# EAGLE design ARE_adaptadora_dsPIC-PIC32_44pin (EAGLE 6.5.0)
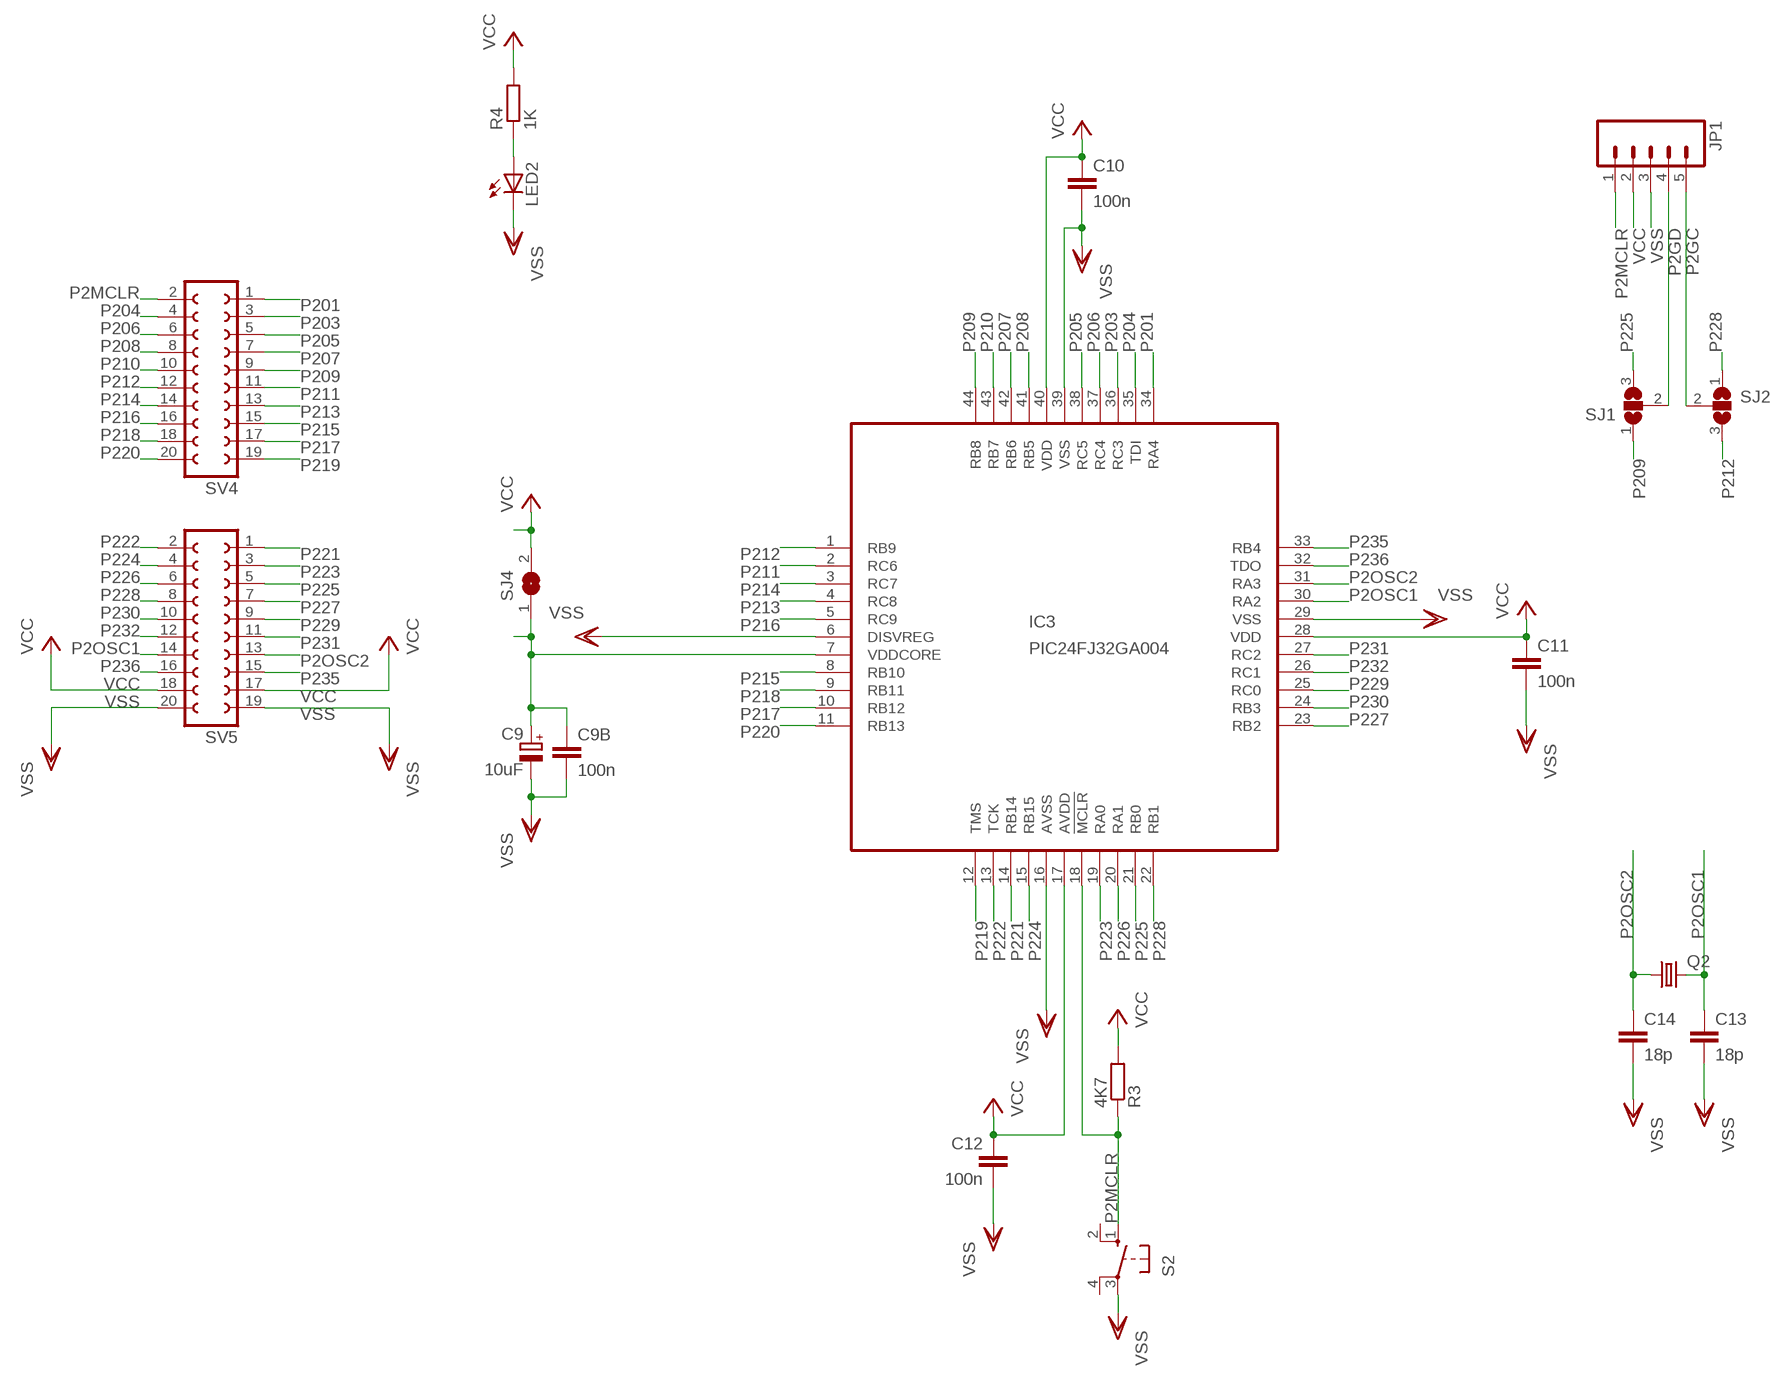
[diagram p0: schematic, sheet 1]

## Parts
C9  10uF  CPOL-EUSMCC  [SMC_C]
C9B  100n  C-EUC0805  [C0805]
C10  100n  C-EUC0805  [C0805]
C11  100n  C-EUC0805  [C0805]
C12  100n  C-EUC0805  [C0805]
C13  18p  C-EUC0805  [C0805]
C14  18p  C-EUC0805  [C0805]
IC3  PIC24FJ32GA004  [TQFP44]
JP1  M05PTH  [1X05]
LED2  LEDCHIPLED_0805  [CHIPLED_0805]
Q2  CRYSTALHC18U-V  [HC18U-V]
R3  4K7  R-EU_R0805  [R0805]
R4  1K  R-EU_R0805  [R0805]
S2  10-XX  [B3F-10XX]
SJ1  SJ2W  [SJ_2]
SJ2  SJ2W  [SJ_2]
SJ4  SJ  [SJ]
SV4  FE10-2W  [FE10-2W]
SV5  FE10-2W  [FE10-2W]

## Nets
N$2: LED2.A R4.1
N$11: C9.+ C9B.1 IC3.7(VDDCORE) SJ4.1
P2GC: JP1.5 SJ2.2
P2GD: JP1.4 SJ1.2
P2MCLR: IC3.18(!MCLR) JP1.1 R3.1 S2.1(S) SV4.2
P2OSC1: C13.1 IC3.30(RA2) Q2.2 SV5.14
P2OSC2: C14.1 IC3.31(RA3) Q2.1 SV5.13
P201: IC3.34(RA4) SV4.1
P203: IC3.36(RC3) SV4.3
P204: IC3.35(TDI) SV4.4
P205: IC3.38(RC5) SV4.5
P206: IC3.37(RC4) SV4.6
P207: IC3.42(RB6) SV4.7
P208: IC3.41(RB5) SV4.8
P209: IC3.44(RB8) SJ1.1 SV4.9
P210: IC3.43(RB7) SV4.10
P211: IC3.2(RC6) SV4.11
P212: IC3.1(RB9) SJ2.3 SV4.12
P213: IC3.4(RC8) SV4.13
P214: IC3.3(RC7) SV4.14
P215: IC3.8(RB10) SV4.15
P216: IC3.5(RC9) SV4.16
P217: IC3.10(RB12) SV4.17
P218: IC3.9(RB11) SV4.18
P219: IC3.12(TMS) SV4.19
P220: IC3.11(RB13) SV4.20
P221: IC3.14(RB14) SV5.1
P222: IC3.13(TCK) SV5.2
P223: IC3.19(RA0) SV5.3
P224: IC3.15(RB15) SV5.4
P225: IC3.21(RB0) SJ1.3 SV5.5
P226: IC3.20(RA1) SV5.6
P227: IC3.23(RB2) SV5.7
P228: IC3.22(RB1) SJ2.1 SV5.8
P229: IC3.25(RC0) SV5.9
P230: IC3.24(RB3) SV5.10
P231: IC3.27(RC2) SV5.11
P232: IC3.26(RC1) SV5.12
P235: IC3.33(RB4) SV5.15
P236: IC3.32(TDO) SV5.16
VCC: C10.1 C11.1 C12.1 IC3.17(AVDD) IC3.28(VDD) IC3.40(VDD) JP1.2 R3.2 R4.2 SJ4.2 SV5.17 SV5.18
VSS: C9.- C9B.2 C10.2 C11.2 C12.2 C13.2 C14.2 IC3.6(DISVREG) IC3.16(AVSS) IC3.29(VSS) IC3.39(VSS) JP1.3 LED2.C S2.3(P) SV5.19 SV5.20
Unconnected: S2.2(S1) S2.4(P1)

## Library data of the parts
C9 = rcl:CPOL-EU: POLARIZED CAPACITOR, European symbol
C9B C10-C14 = rcl:C-EU: CAPACITOR, European symbol
IC3 = microchip:PIC24FJ32GA004: PIC24FJ32GA004 edit this description Auto generated by make-symbol-device-package-bsdl.ulp Rev. 25 Source: PIC24FJ32GA004.bsd; MPN: PIC24FJ32GA004-E/PT; OC_FARNELL: 1332295; OC_NEWARK: 98M1915
JP1 = SparkFun:M05: Header 5 Standard 5-pin 0.1" header. Use with straight break away headers (SKU : PRT-00116), right angle break away headers (PRT-00553), swiss pins (PRT-00743), machine pins (PRT-00117), and female headers (PRT-00115). Molex polarized connector foot print use with SKU : PRT-08230 with associated crimp pins and housings.
LED2 = led:LED: LED OSRAM: - CHIPLED LG R971, LG N971, LY N971, LG Q971, LY Q971, LO R971, LY R971 LH N974, LH R974 LS Q976, LO Q976, LY Q976 LO Q996 - Hyper CHIPLED LW Q18S LB Q993, LB Q99A, LB R99A - SideLED LS A670, LO A670, LY A670, LG A670, LP A670 LB A673, LV A673, LT A673, LW A673 LH A674 LY A675 LS A676, LA A676, LO A676, LY A676, LW A676 LS A679, LY A679, LG A679 - Hyper Micro SIDELED® LS Y876, LA Y876, LO Y876, LY Y876 LT Y87S - SmartLED LW L88C, LW L88S LB L89C, LB L89S, LG L890 LS L89K, LO L89K, LY L89K LS L896, LA L896, LO L896, LY L896 - TOPLED LS T670, LO T670, LY T670, LG T670, LP T670 LSG T670, LSP T670, LSY T670, LOP T670, LYG T670 LG T671, LOG T671, LSG T671 LB T673, LV T673, LT T673, LW T673 LH T674 LS T676, LA T676, LO T676, LY T676, LB T676, LH T676, LSB T676, LW T676 LB T67C, LV T67C, LT T67C, LS T67K, LO T67K, LY T67K, LW E67C LS E67B, LA E67B, LO E67B, LY E67B, LB E67C, LV E67C, LT E67C LW T67C LS T679, LY T679, LG T679 LS T770, LO T770, LY T770, LG T770, LP T770 LB T773, LV T773, LT T773, LW T773 LH T774 LS E675, LA E675, LY E675, LS T675 LS T776, LA T776, LO T776, LY T776, LB T776 LHGB T686 LT T68C, LB T68C - Hyper Mini TOPLED® LB M676 - Mini TOPLED Santana® LG M470 LS M47K, LO M47K, LY M47K Source: http://www.osram.convergy.de LUXEON: - LUMILED® LXK2-PW12-R00, LXK2-PW12-S00, LXK2-PW14-U00, LXK2-PW14-V00 LXK2-PM12-R00, LXK2-PM12-S00, LXK2-PM14-U00 LXK2-PE12-Q00, LXK2-PE12-R00, LXK2-PE12-S00, LXK2-PE14-T00, LXK2-PE14-U00 LXK2-PB12-K00, LXK2-PB12-L00, LXK2-PB12-M00, LXK2-PB14-N00, LXK2-PB14-P00, LXK2-PB14-Q00 LXK2-PR12-L00, LXK2-PR12-M00, LXK2-PR14-Q00, LXK2-PR14-R00 LXK2-PD12-Q00, LXK2-PD12-R00, LXK2-PD12-S00 LXK2-PH12-R00, LXK2-PH12-S00 LXK2-PL12-P00, LXK2-PL12-Q00, LXK2-PL12-R00 Source: www.luxeon.com KINGBRIGHT: KA-3528ASYC Source: www.kingbright.com
Q2 = crystal:CRYSTAL: CRYSTAL; OC_FARNELL: unknown; OC_NEWARK: unknown
R3 R4 = rcl:R-EU_: RESISTOR, European symbol
S2 = switch-omron:10-XX: OMRON SWITCH; MPN: B3F-1000; OC_FARNELL: 176432; OC_NEWARK: 36M3542
SJ1 SJ2 = jumper:SJ2W: SMD solder JUMPER
SJ4 = jumper:SJ: SMD solder JUMPER
SV4 SV5 = con-lsta:FE10-2W: FEMALE HEADER; OC_FARNELL: unknown; OC_NEWARK: unknown

## Board
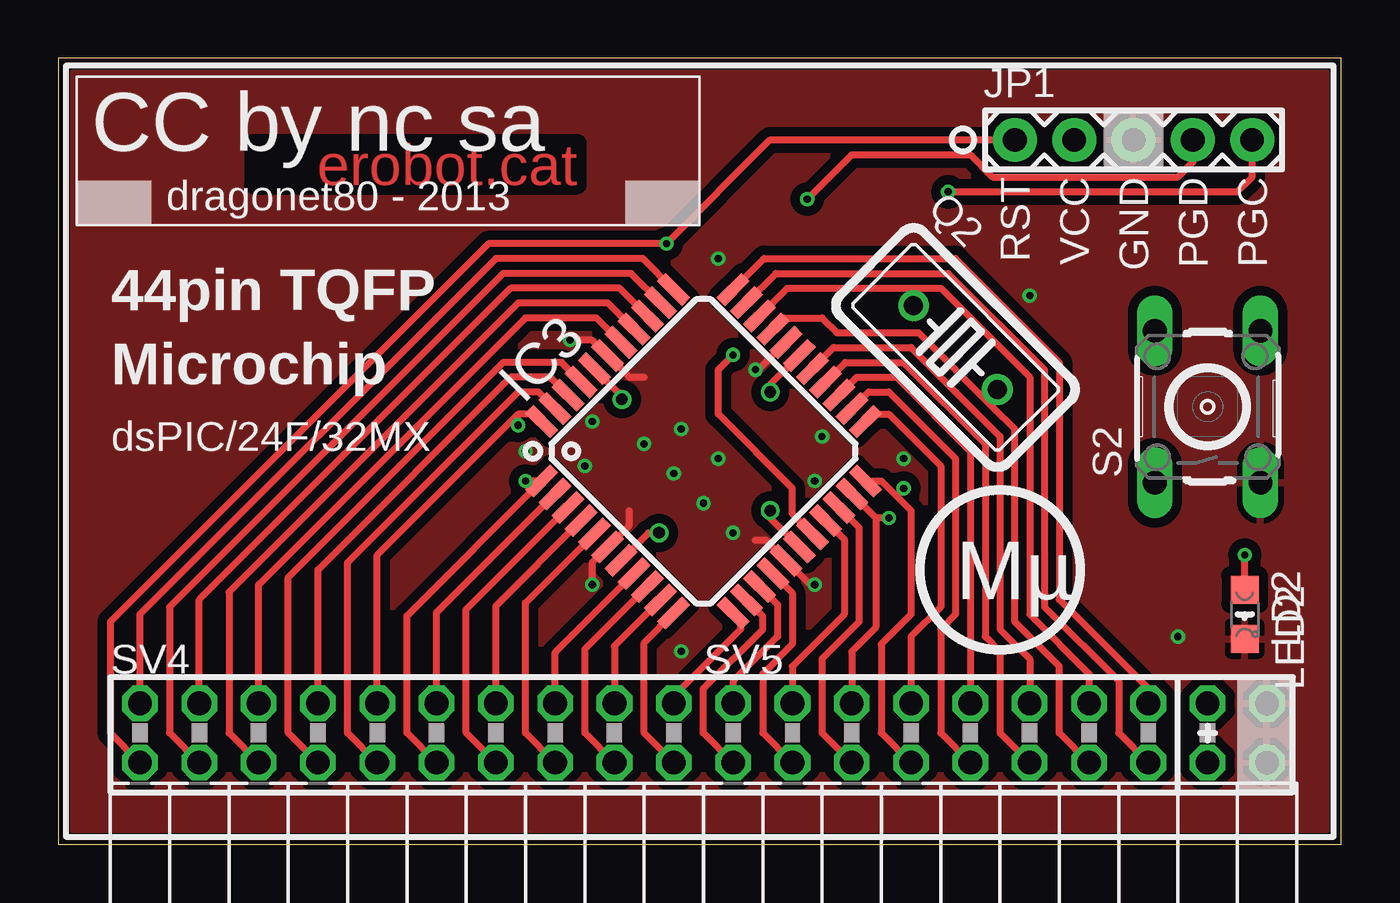
[diagram p1: board, top side]
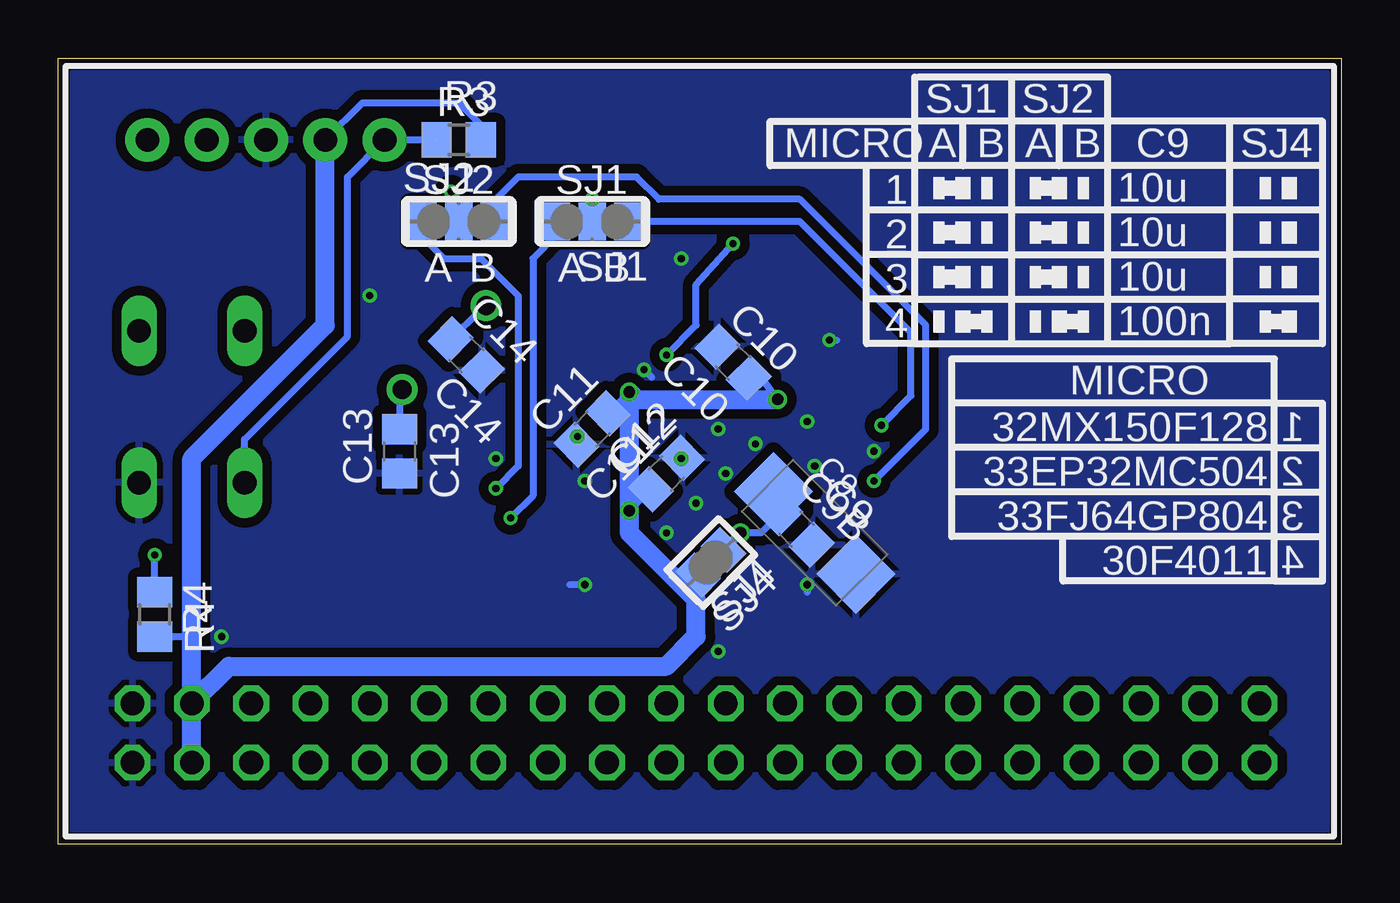
[diagram p2: board, bottom side, seen from below]

Size 54.93 x 33.66 mm. Coordinates in mm from the lower left corner, seen from the top.
Outline: 54.93,33.65 0,33.65 0,0 54.93,0 54.93,33.65
Copper layers (1*16): Top 0.035mm / dielectric 1.5mm / Bottom 0.035mm
Design rules "ITEADstudio_DRC": minimum track width 6mil, minimum drill 12mil, track to track 6mil, track to pad 6mil, pad to pad 6mil, via to via 6mil, smd to smd 0mil, copper to edge 10mil, drill to drill 10mil, minimum pad ring 10mil, minimum via ring 6mil, stop-mask expansion 2mil, vias tented up to drill 100mil, thermal gap 10mil

### Footprints (pad centres in the part's own frame; a part is rotated, then mirrored left to right if it is on the bottom)
SMC_C = smd 2.4 x 2.4: + -2.5,0; - 2.5,0
C0805 = smd 1.3 x 1.5: 1 -0.95,0; 2 0.95,0
TQFP44 = smd 1.5 x 0.5: 1 -5.8,4; 2 -5.8,3.2; 3 -5.8,2.4; 4 -5.8,1.6; 5 -5.8,0.8; 6 -5.8,0; 7 -5.8,-0.8; 8 -5.8,-1.6; 9 -5.8,-2.4; 10 -5.8,-3.2; 11 -5.8,-4; 23 5.8,-4; 24 5.8,-3.2; 25 5.8,-2.4; 26 5.8,-1.6; 27 5.8,-0.8; 28 5.8,0; 29 5.8,0.8; 30 5.8,1.6; 31 5.8,2.4; 32 5.8,3.2; 33 5.8,4 | smd 0.5 x 1.5: 12 -4,-5.8; 13 -3.2,-5.8; 14 -2.4,-5.8; 15 -1.6,-5.8; 16 -0.8,-5.8; 17 0,-5.8; 18 0.8,-5.8; 19 1.6,-5.8; 20 2.4,-5.8; 21 3.2,-5.8; 22 4,-5.8; 34 4,5.8; 35 3.2,5.8; 36 2.4,5.8; 37 1.6,5.8; 38 0.8,5.8; 39 0,5.8; 40 -0.8,5.8; 41 -1.6,5.8; 42 -2.4,5.8; 43 -3.2,5.8; 44 -4,5.8
1X05 = drill 1.016 pad 1.88: 1 0,0; 2 2.54,0; 3 5.08,0; 4 7.62,0; 5 10.16,0
CHIPLED_0805 = smd 1.2 x 1.2: A 0,-1.05; C 0,1.05
HC18U-V = drill 0.813: 1 -2.54,0; 2 2.54,0
R0805 = smd 1.3 x 1.5: 1 -0.95,0; 2 0.95,0
B3F-10XX = drill 1.016 long: 1 -3.251,2.261; 2 3.251,2.261; 3 -3.251,-2.261; 4 3.251,-2.261
SJ_2 = smd 1.168 x 1.6: 1 -1.524,0; 2 0,0; 3 1.524,0
SJ = smd 1.168 x 1.6: 1 -0.762,0; 2 0.762,0
FE10-2W = drill 1.016 octagon: 1 -11.43,1.27; 2 -11.43,-1.27; 3 -8.89,1.27; 4 -8.89,-1.27; 5 -6.35,1.27; 6 -6.35,-1.27; 7 -3.81,1.27; 8 -3.81,-1.27; 9 -1.27,1.27; 10 -1.27,-1.27; 11 1.27,1.27; 12 1.27,-1.27; 13 3.81,1.27; 14 3.81,-1.27; 15 6.35,1.27; 16 6.35,-1.27; 17 8.89,1.27; 18 8.89,-1.27; 19 11.43,1.27; 20 11.43,-1.27

### Placement (x,y rotation side)
C9  22.54,13.34 315 bottom
C9B  23.34,13.49 315 bottom
C10  26.03,20.64 135 bottom
C11  32.07,17.78 225 bottom
C12  28.89,15.88 45 bottom
C13  40.32,16.83 270 bottom
C14  37.47,20.95 315 bottom
IC3  27.62,16.83 45 top
JP1  40.96,30.16 0 top
LED2  50.8,9.84 180 top
Q2  38.42,21.27 315 top
R3  37.78,30.16 0 bottom
R4  50.8,9.84 270 bottom
S2  49.21,18.73 90 top
SJ1  32.07,26.67 180 bottom
SJ2  37.78,26.67 0 bottom
SJ4  26.99,12.06 225 bottom
SV4  14.92,4.76 0 top
SV5  40.32,4.76 0 top

### Tracks (layer width: path | path; a pad name or v marks a point on that pad's centre or on a via)
N$2  (via drill 0.3 pad 0.61)
  Top 0.305: LED2.A v50.8,12.38
  Bottom 0.305: R4.1 v50.8,12.38
N$11  (via drill 0.5 pad 0.61)
  Top 0.305: v25.72,13.34 25.26,13.34 IC3.7
  Bottom 0.305: C9.+ 24.01,15.1 C9B.1 24.84,13.34 v25.72,13.34
  Bottom 0.406: SJ4.1 v25.72,13.34
P2GC  (via drill 0.3 pad 0.61)
  Top 0.305: v38.1,27.94 50.48,27.94 51.12,28.57 JP1.5
  Bottom 0.305: SJ2.2 37.78,27.62 v38.1,27.94
P2GD  (via drill 0.3 pad 0.61)
  Top 0.305: v32.07,27.62 33.97,29.53 39.05,29.53 40,28.57 47.94,28.57 48.58,29.21 JP1.4
  Bottom 0.305: SJ1.2 v32.07,27.62
P2MCLR  (via drill 0.3 pad 0.61)  (1 unrouted)
  Top 0.305: IC3.18 31.43,14.15 31.43,15.24 28.26,18.42 28.26,20.32 v28.89,20.95 | SV4.2 2.22,4.76 2.22,9.53 18.41,25.72 v26.03,25.72 30.48,30.16 JP1.1
  Bottom 0.305: v28.89,20.95 27.62,22.23 27.62,23.97 v26.03,25.72 | S2.1 46.95,17.34 42.55,21.75 42.55,28.57 JP1.1 R3.1
P2OSC1
  Top 0.305: IC3.30 31.08,22.54 32.7,22.54 33.34,21.91 36.83,21.91 40,18.73 | 40,18.73 40.96,17.78 40.96,9.53 42.86,7.62 42.86,4.76 SV5.14 | Q2.2 40,19.27 40,18.73
  Bottom 0.305: Q2.2 40.32,19.37 C13.1
P2OSC2
  Top 0.305: IC3.31 31.21,23.81 36.51,23.81 | 36.51,23.81 37.78,23.81 41.59,20 41.59,9.84 44.13,7.3 SV5.13 | Q2.1 36.51,23.18 36.51,23.81
  Bottom 0.305: Q2.1 36.87,22.82 C14.1
P201
  Top 0.305: IC3.34 25.02,25.08 18.73,25.08 3.49,9.84 SV4.1
P203
  Top 0.305: IC3.36 24.03,23.81 19.37,23.81 6.03,10.48 SV4.3
P204
  Top 0.305: IC3.35 24.53,24.45 19.05,24.45 4.76,10.16 4.76,4.76 SV4.4
P205
  Top 0.305: IC3.38 23.04,22.54 20,22.54 8.57,11.11 SV4.5
P206
  Top 0.305: IC3.37 23.53,23.18 19.69,23.18 7.3,10.79 7.3,4.76 SV4.6
P207
  Top 0.305: IC3.42 21.05,20 19.37,20 11.11,11.75 SV4.7
P208
  Top 0.305: IC3.41 21.55,20.64 19.05,20.64 9.84,11.43 9.84,4.76 SV4.8
P209  (via drill 0.3 pad 0.61)
  Top 0.305: IC3.44 20.38,18.42 19.69,18.42 | 19.69,18.42 13.65,12.38 SV4.9 | v19.69,17.94 19.69,18.42
  Bottom 0.305: v19.69,17.94 18.41,19.21 18.41,21.91 23.18,26.67 SJ1.1
P210
  Top 0.305: IC3.43 20.56,19.37 19.69,19.37 12.38,12.06 12.38,4.76 SV4.10
P211
  Top 0.305: SV4.11 16.19,9.92 IC3.2
P212  (via drill 0.3 pad 0.61)
  Top 0.305: v20,15.56 IC3.1 14.92,9.78 14.92,4.76 SV4.12
  Bottom 0.305: v20,15.56 17.78,17.78 17.78,22.23 23.18,27.62 29.21,27.62 30.16,28.57 35.24,28.57 36.19,27.62 36.19,26.73 SJ2.3
P213
  Top 0.305: SV4.13 18.73,10.2 IC3.4
P214
  Top 0.305: SV4.14 17.46,4.76 17.46,10.06 IC3.3
P215
  Top 0.305: SV4.15 21.27,8.21 IC3.8
P216
  Top 0.305: SV4.16 20,4.76 20,10.34 IC3.5
P217
  Top 0.305: IC3.10 23.81,8.49 SV4.17
P218
  Top 0.305: SV4.18 22.54,4.76 22.54,8.35 IC3.9
P219
  Top 0.305: IC3.12 29.21,9.58 29.21,9.21 26.35,6.35 SV4.19
P220
  Top 0.305: 26.03,9.58 IC3.11 25.08,8.63 25.08,4.76 SV4.20
P221
  Top 0.305: IC3.14 30.8,10.26 30.8,8.89 28.89,6.98 SV5.1
P222
  Top 0.305: IC3.13 30.16,9.76 30.16,9.21 27.62,6.67 27.62,4.76 SV5.2
P223
  Top 0.305: IC3.19 33.66,13.06 33.66,9.84 31.43,7.62 SV5.3
P224
  Top 0.305: IC3.15 31.43,10.75 31.43,8.57 30.16,7.3 30.16,4.76 SV5.4
P225  (via drill 0.3 pad 0.61)
  Top 0.305: v35.56,13.97 35,13.97 | IC3.21 35,13.97 | 35,13.97 35,9.29 33.97,8.26 SV5.5
  Bottom 0.305: SJ1.3 33.59,26.1 34.61,25.08 34.61,14.92 v35.56,13.97
P226
  Top 0.305: IC3.20 34.29,13.55 34.29,9.53 32.7,7.94 32.7,4.76 SV5.6
P227
  Top 0.305: IC3.23 34.87,18.42 35.56,18.42 37.78,16.19 37.78,10.16 36.51,8.89 SV5.7
P228  (via drill 0.3 pad 0.61)
  Top 0.305: IC3.22 35.24,15.55 35.88,14.92 | 35.88,14.92 36.51,14.29 36.51,9.84 35.24,8.57 35.24,4.76 SV5.8 | 35.88,14.92 v36.19,15.24
  Bottom 0.305: SJ2.1 39.31,25.97 38.42,25.08 36.83,25.08 35.24,23.5 35.24,16.19 v36.19,15.24
P229
  Top 0.305: IC3.25 34.19,20 35.88,20 39.05,16.83 SV5.9
P230
  Top 0.305: IC3.24 34.69,19.37 35.56,19.37 38.42,16.51 38.42,9.84 37.78,9.21 37.78,4.76 SV5.10
P231
  Top 0.305: IC3.27 33.2,21.27 36.51,21.27 40.32,17.46 40.32,9.21 41.59,7.94 SV5.11
P232
  Top 0.305: IC3.26 33.69,20.64 36.19,20.64 39.69,17.15 39.69,8.89 40.32,8.26 40.32,4.76 SV5.12
P235
  Top 0.305: IC3.33 30.22,25.08 38.42,25.08 42.86,20.64 42.86,10.48 46.67,6.67 SV5.15
P236
  Top 0.305: IC3.32 30.72,24.45 38.1,24.45 42.23,20.32 42.23,10.16 45.4,6.98 45.4,4.76 SV5.16
VCC  (via drill 0.5 pad 0.61)
  Top 0.305: IC3.17 30.48,13.97 v30.48,14.29 | IC3.28 30.48,19.68 v30.48,19.37 | IC3.40 23.95,19.37 v24.13,19.05
  Bottom 0.305: C12.1 v30.48,14.29 | v30.48,14.29 | v30.48,19.37 C11.1 | v24.13,19.05 24.8,19.97 C10.1 | JP1.2 41.91,31.75 37.78,31.75 36.83,30.8 R3.2 | R4.2 49.53,8.89 49.21,8.57
  Bottom 0.406: SJ4.2 28.1,10.95
  Bottom 0.813: v24.13,19.05 30.16,19.05 v30.48,19.37 v30.48,14.29 30.48,13.34 28.1,10.95 27.62,10.48 27.62,8.89 28.89,7.62 47.62,7.62 SV5.17 | SV5.17 49.21,8.57 49.21,16.51 43.5,22.23 JP1.2 | SV5.18 SV5.17
VSS  (via drill 0.3 pad 0.61)
  Top 0.305: v32.38,11.11 32.21,11.11 IC3.16 30.3,13.02 29.84,13.02 | v21.91,21.59 22.86,21.59 IC3.39 24.45,20 25.08,20 | IC3.29 29.98,20.32 v29.84,20.32 | v22.86,11.11 22.86,12.06 IC3.6 24.45,13.65 24.45,14.29
  Bottom 0.305: v32.38,11.11 33.02,11.11 | v21.91,21.59 21.59,21.59 | v29.84,20.32 29.53,20 | v22.86,11.11 22.86,10.79
  other vias: 20,16.83 36.19,16.51 28.26,25.08 27.62,14.61 26.67,17.78 41.59,23.5 47.94,8.89 26.67,8.26 28.26,16.51 32.7,17.46 26.35,15.88 22.86,18.1 22.54,16.19 32.38,15.56 28.89,13.34 25.08,17.15
  pour Bottom (isolate 0.406): 0.63,0.64 54.29,0.64 54.29,33.02 0.63,33.02
  pour Top (isolate 0.406): 0.63,0.64 54.29,0.64 54.29,33.02 0.63,33.02

### Text on the board
Top: erobot.cat
_tsilk: CC by nc sa | RST | VCC | GND | PGD | PGC | dragonet80 - 2013 | 44pin TQFP | Microchip | dsPIC/24F/32MX | LD2 | Mµ
_bsilk: SJ2 | SJ1 | R3 | SJ4 | C9 | B | A | B | A | MICRO | 1 | SJ1 | SJ2 | 10u | 2 | 10u | 3 | B | A | B | A | 10u | 4 | 100n | C10 | MICRO | 1 | 32MX150F128 | C14 | C11 | 2 | 33EP32MC504 | C9 | C12 | C13 | 3 | 33FJ64GP804 | 4 | 30F4011 | R4 | SJ4